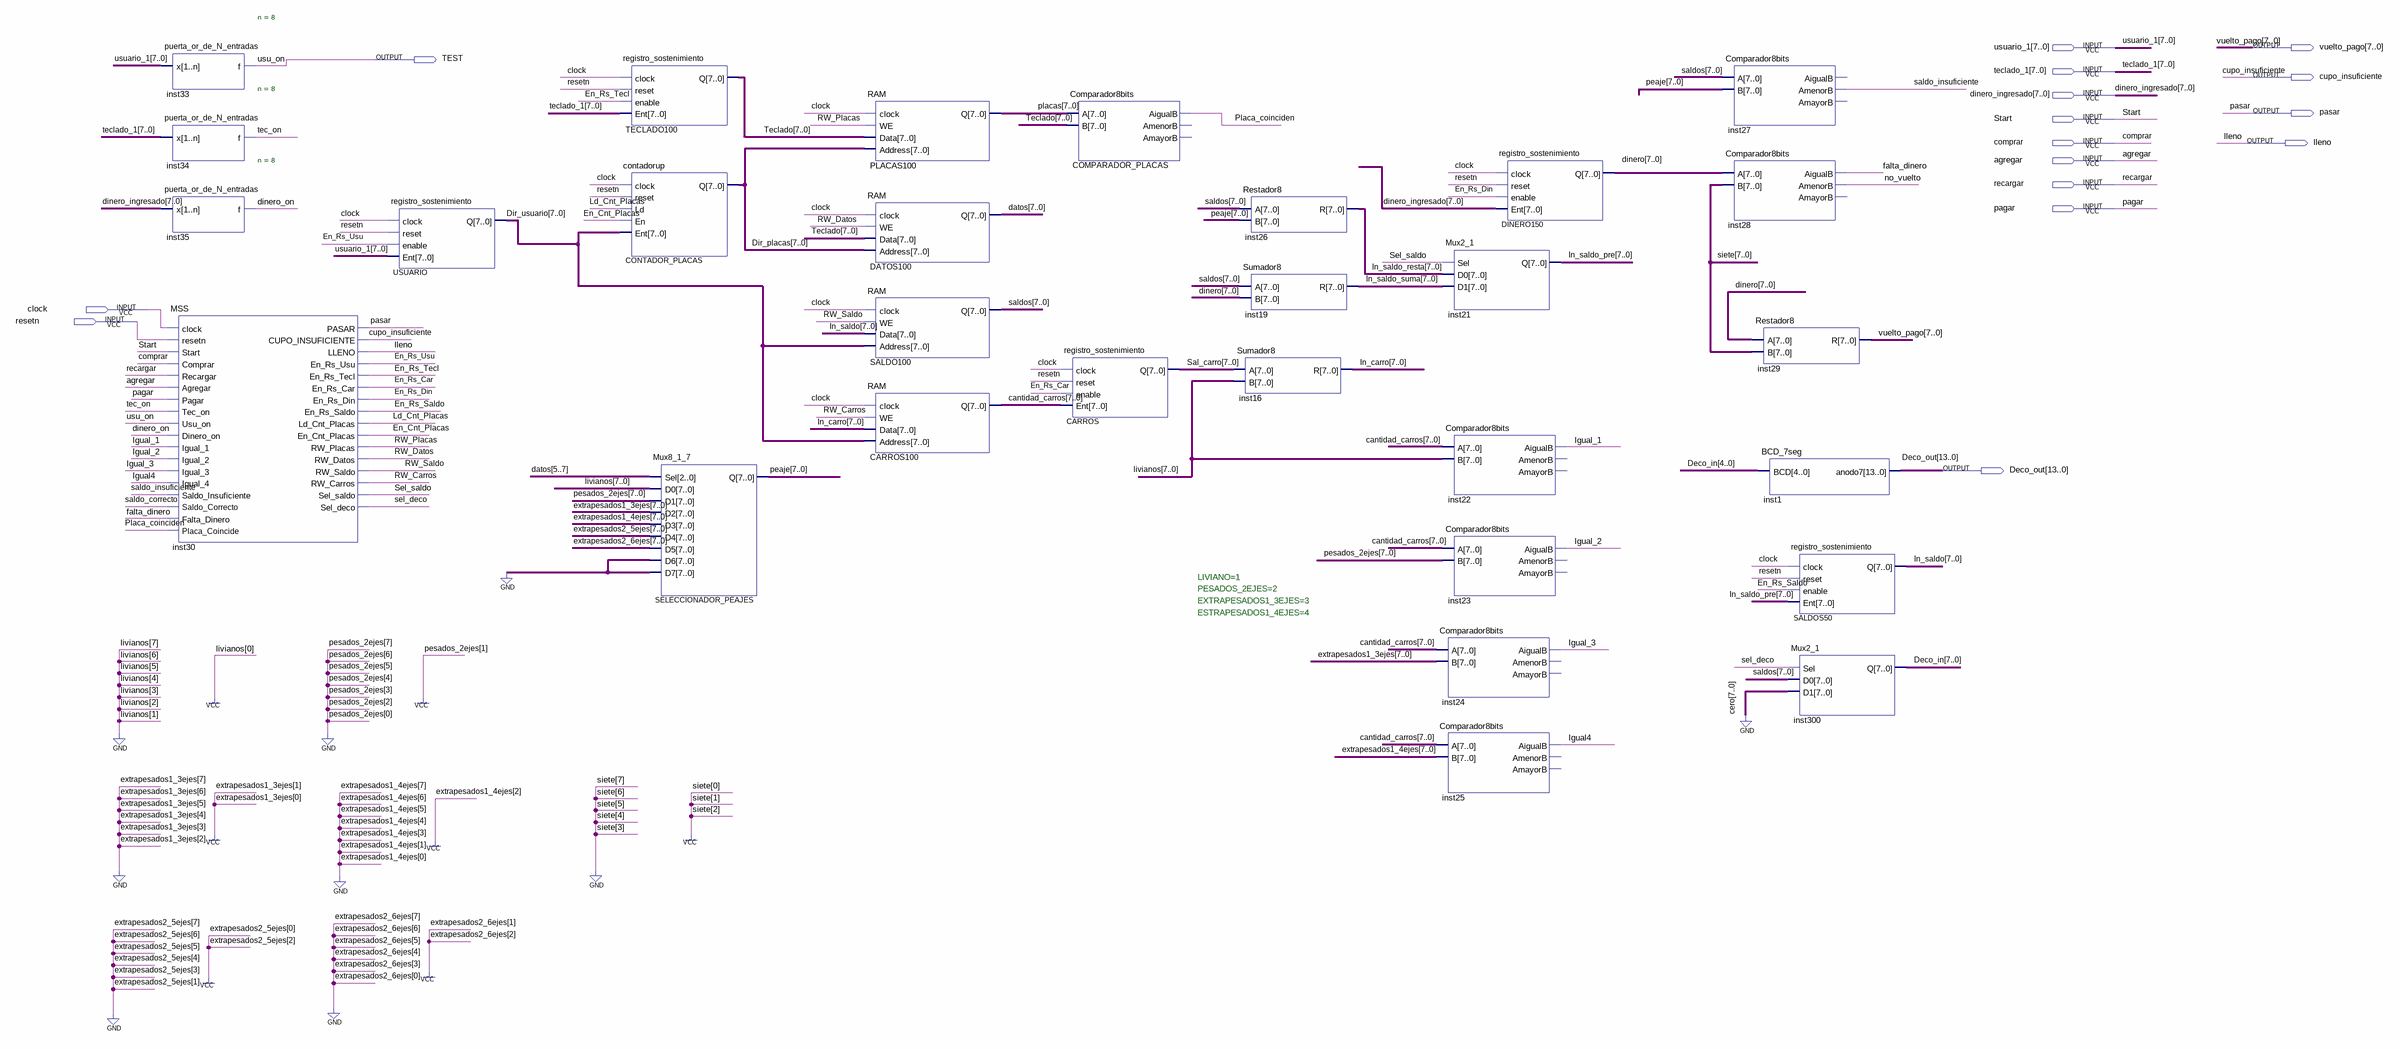
[diagram p0: schematic sheet]
// Quartus schematic proyecto.bdf as structural Verilog: 29 symbols, 16 pins
module proyecto (
  input  [7:0] usuario_1,
  input  [7:0] teclado_1,
  input  [7:0] dinero_ingresado,
  input  Start,
  input  comprar,
  input  agregar,
  input  recargar,
  input  pagar,
  input  clock,
  input  resetn,
  output [7:0] vuelto_pago,
  output TEST,
  output cupo_insuficiente,
  output pasar,
  output lleno,
  output [13:0] Deco_out
);

  wire dinero_on, En_Cnt_Placas, En_Rs_Car, En_Rs_Din, En_Rs_Saldo, En_Rs_Tecl, En_Rs_Usu, falta_dinero,
       Igual4, Igual_1, Igual_2, Igual_3, Ld_Cnt_Placas, no_vuelto, Placa_coinciden, RW_Carros, RW_Datos,
       RW_Placas, RW_Saldo, saldo_correcto, saldo_insuficiente, sel_deco, Sel_saldo, tec_on;
  wire [7:0] cantidad_carros, datos, Deco_in, dinero, Dir_placas, Dir_usuario, In_carro, In_saldo,
       In_saldo_pre, In_saldo_resta, In_saldo_suma, peaje, placas, Sal_carro, saldos, Teclado;

  puerta_or_de_N_entradas #(.n(8)) inst33 (.x(usuario_1), .f(TEST));
  puerta_or_de_N_entradas #(.n(8)) inst34 (.x(teclado_1), .f(tec_on));
  puerta_or_de_N_entradas #(.n(8)) inst35 (.x(dinero_ingresado), .f(dinero_on));
  MSS inst30 (
    .clock(clock), .resetn(resetn), .Start(Start), .Comprar(comprar), .Recargar(recargar), .Agregar(agregar),
    .Pagar(pagar), .Tec_on(tec_on), .Usu_on(TEST), .Dinero_on(dinero_on), .Igual_1(Igual_1),
    .Igual_2(Igual_2), .Igual_3(Igual_3), .Igual_4(Igual4), .Saldo_Insuficiente(saldo_insuficiente),
    .Saldo_Correcto(saldo_correcto), .Falta_Dinero(falta_dinero), .Placa_Coincide(Placa_coinciden),
    .PASAR(pasar), .CUPO_INSUFICIENTE(cupo_insuficiente), .LLENO(lleno), .En_Rs_Usu(En_Rs_Usu),
    .En_Rs_Tecl(En_Rs_Tecl), .En_Rs_Car(En_Rs_Car), .En_Rs_Din(En_Rs_Din), .En_Rs_Saldo(En_Rs_Saldo),
    .Ld_Cnt_Placas(Ld_Cnt_Placas), .En_Cnt_Placas(En_Cnt_Placas), .RW_Placas(RW_Placas), .RW_Datos(RW_Datos),
    .RW_Saldo(RW_Saldo), .RW_Carros(RW_Carros), .Sel_saldo(Sel_saldo), .Sel_deco(sel_deco));
  registro_sostenimiento USUARIO (.clock(clock), .reset(resetn), .enable(En_Rs_Usu), .Ent(usuario_1), .Q(Dir_usuario));
  registro_sostenimiento TECLADO100 (.clock(clock), .reset(resetn), .enable(En_Rs_Tecl), .Ent(teclado_1), .Q(Teclado));
  contadorup CONTADOR_PLACAS (
    .clock(clock), .reset(resetn), .Ld(Ld_Cnt_Placas), .En(En_Cnt_Placas), .Ent(Dir_usuario), .Q(Dir_placas));
  Mux8_1_7 SELECCIONADOR_PEAJES (
    .Sel({datos[5], datos[6], datos[7]}), .D0(8'b00000001), .D1(8'b00000010), .D2(8'b00000011),
    .D3(8'b00000100), .D4(8'b00000101), .D5(8'b00000110), .D6({8{1'b0}}), .D7({8{1'b0}}), .Q(peaje));
  RAM PLACAS100 (.clock(clock), .WE(RW_Placas), .Data(Teclado), .Address(Dir_placas), .Q(placas));
  RAM DATOS100 (.clock(clock), .WE(RW_Datos), .Data(Teclado), .Address(Dir_placas), .Q(datos));
  RAM SALDO100 (.clock(clock), .WE(RW_Saldo), .Data(In_saldo), .Address(Dir_usuario), .Q(saldos));
  RAM CARROS100 (.clock(clock), .WE(RW_Carros), .Data(In_carro), .Address(Dir_usuario), .Q(cantidad_carros));
  Comparador8bits COMPARADOR_PLACAS (.A(placas), .B(Teclado), .AigualB(Placa_coinciden));  // open: AmenorB, AmayorB
  registro_sostenimiento CARROS (
    .clock(clock), .reset(resetn), .enable(En_Rs_Car), .Ent(cantidad_carros), .Q(Sal_carro));
  Restador8 inst26 (.A(saldos), .B(peaje), .R(In_saldo_resta));
  Sumador8 inst19 (.A(saldos), .B(dinero), .R(In_saldo_suma));
  Sumador8 inst16 (.A(Sal_carro), .B(8'b00000001), .R(In_carro));
  Mux2_1 inst21 (.Sel(Sel_saldo), .D0(In_saldo_resta), .D1(In_saldo_suma), .Q(In_saldo_pre));
  Comparador8bits inst22 (.A(cantidad_carros), .B(8'b00000001), .AigualB(Igual_1));  // open: AmenorB, AmayorB
  Comparador8bits inst23 (.A(cantidad_carros), .B(8'b00000010), .AigualB(Igual_2));  // open: AmenorB, AmayorB
  Comparador8bits inst24 (.A(cantidad_carros), .B(8'b00000011), .AigualB(Igual_3));  // open: AmenorB, AmayorB
  Comparador8bits inst25 (.A(cantidad_carros), .B(8'b00000100), .AigualB(Igual4));  // open: AmenorB, AmayorB
  registro_sostenimiento DINERO150 (
    .clock(clock), .reset(resetn), .enable(En_Rs_Din), .Ent(dinero_ingresado), .Q(dinero));
  Comparador8bits inst27 (.A(saldos), .B(peaje), .AmenorB(saldo_insuficiente));  // open: AigualB, AmayorB
  Comparador8bits inst28 (.A(dinero), .B(8'b00000111), .AigualB(falta_dinero), .AmenorB(no_vuelto));  // open: AmayorB
  Restador8 inst29 (.A(dinero), .B(8'b00000111), .R(vuelto_pago));
  BCD_7seg inst1 (.BCD(Deco_in[4:0]), .anodo7(Deco_out));
  registro_sostenimiento SALDOS50 (
    .clock(clock), .reset(resetn), .enable(En_Rs_Saldo), .Ent(In_saldo_pre), .Q(In_saldo));
  Mux2_1 inst300 (.Sel(sel_deco), .D0(saldos), .D1({8{1'b0}}), .Q(Deco_in));

  // Other names for the same wires on the sheet: usu_on = TEST

  // Notes on the sheet:
  //   LIVIANO=1
  //   PESADOS_2EJES=2
  //   EXTRAPESADOS1_3EJES=3
  //   ESTRAPESADOS1_4EJES=4
endmodule
